# Altium project SmartGarden_A2.PrjPcb
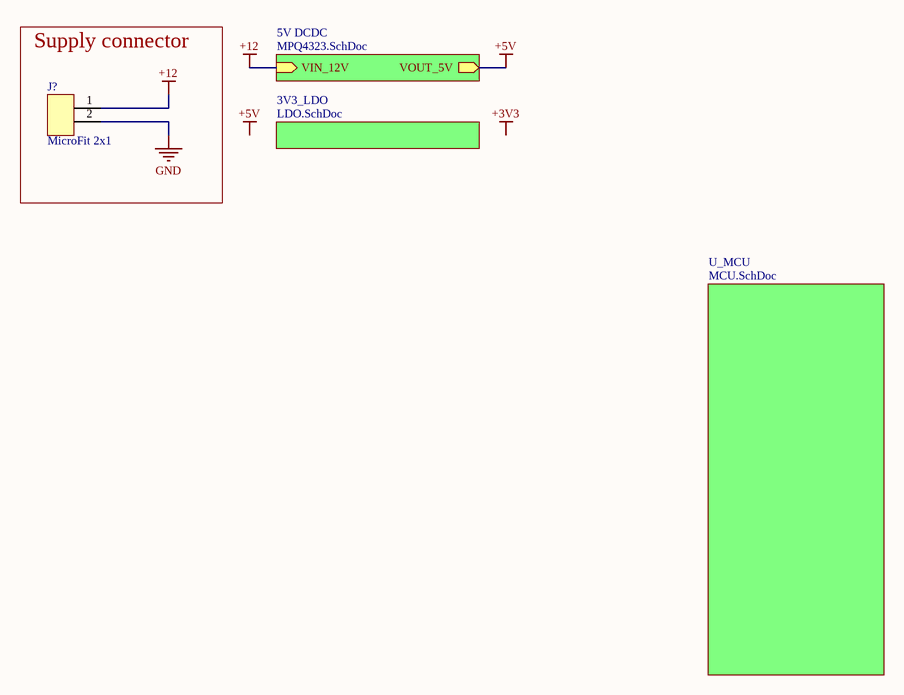
[diagram p0: SG_A2 Architecture.SchDoc]
3 sheets, 10 parts. Net scope: hierarchical (ports join the sheet entries above them; power ports are global).
Sheets:
  SG_A2 Architecture.SchDoc
    U_MCU = MCU.SchDoc
  Button.SchDoc

## Sheet SG_A2 Architecture.SchDoc
size A4; SheetNumber: 1; SheetTotal: 5

### Parts
J?  MicroFit 2x1  [MOLEX_43045-0200]

### Blocks framed on the sheet
Supply connector: J?

### Sub-sheets
3V3_LDO = LDO.SchDoc (file not in this document): no entries
5V DCDC = MPQ4323.SchDoc (file not in this document): VIN_12V (in), VOUT_5V (out)
U_MCU = MCU.SchDoc: no entries

### Nets
+5V: sheet 5V DCDC/VOUT_5V
+12: J?.1 ; sheet 5V DCDC/VIN_12V
GND: J?.2

### Notes on the sheet
- Labels drawn without touching a wire or pin: +3V3, +5V

## Sheet MCU.SchDoc
size A4; SheetNumber: 4; SheetTotal: 6
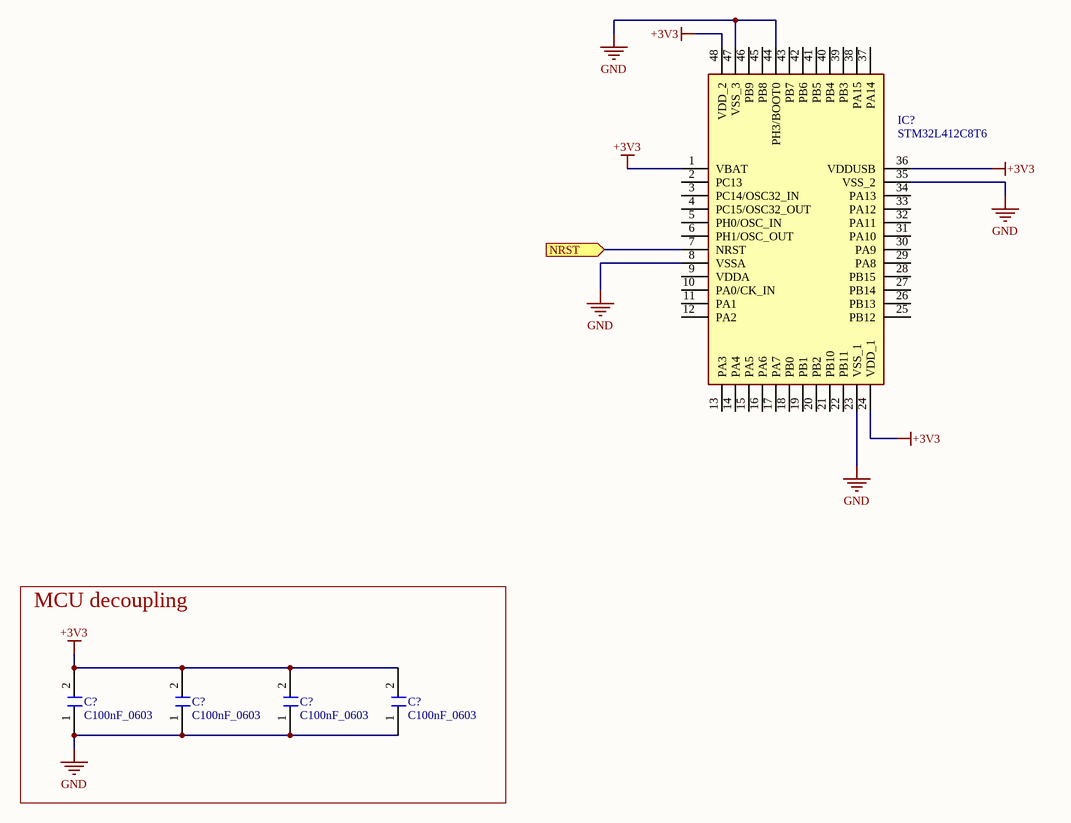
[diagram p1: MCU.SchDoc]

### Parts
(Parts that share a designator on the sheet are numbered #1, #2 ... from top to bottom, then left to right.)
C?#1  C100nF_0603  [Chip2PinSM127P600-8N]
C?#2  C100nF_0603  [Chip2PinSM127P600-8N]
C?#3  C100nF_0603  [Chip2PinSM127P600-8N]
C?#4  C100nF_0603  [Chip2PinSM127P600-8N]
IC?  STM32L412C8T6  [QFP50P900X900X160-48N]

### Blocks framed on the sheet
MCU decoupling: C?#1-C?#4

### Ports
NRST (in)

### Nets
+3V3: C?#1.2 C?#2.2 C?#3.2 C?#4.2 IC?.1(VBAT) IC?.24(VDD_1) IC?.36(VDDUSB) IC?.48(VDD_2)
GND: C?#1.1 C?#2.1 C?#3.1 C?#4.1 IC?.8(VSSA) IC?.23(VSS_1) IC?.35(VSS_2) IC?.44(PH3/BOOT0) IC?.47(VSS_3)
NetIC?_7: IC?.7(NRST) ; port NRST

Not connected (* = marked no-connect by the designer): IC? 2(PC13) 3(PC14/OSC32_IN) 4(PC15/OSC32_OUT) 5(PH0/OSC_IN) 6(PH1/OSC_OUT) 9(VDDA) 10(PA0/CK_IN) 11(PA1) 12(PA2) 13(PA3) 14(PA4) 15(PA5) 16(PA6) 17(PA7) 18(PB0) 19(PB1) 20(PB2) 21(PB10) 22(PB11) 25(PB12) 26(PB13) 27(PB14) 28(PB15) 29(PA8) 30(PA9) 31(PA10) 32(PA11) 33(PA12) 34(PA13) 37(PA14) 38(PA15) 39(PB3) 40(PB4) 41(PB5) 42(PB6) 43(PB7) 45(PB8) 46(PB9)

### Library data of the parts
IC? = STM32L412C8T6: STMICROELECTRONICS - STM32L412C8T6 - MCU, 32BIT, 80MHZ; Geometry.Height: 1.6mm; Mouser Part Number: 511-STM32L412C8T6; Mouser Price/Stock: https://www.mouser.co.uk/ProductDetail/STMicroelectronics/STM32L412C8T6?qs=l7cgNqFNU1hAS2azFRLB0A%3D%3D; Manufacturer_Name: STMicroelectronics; Manufacturer_Part_Number: STM32L412C8T6; Datasheet Link: https://www.st.com/resource/en/datasheet/stm32l412c8.pdf

## Sheet Button.SchDoc
size A4; SheetNumber: 5; SheetTotal: 5
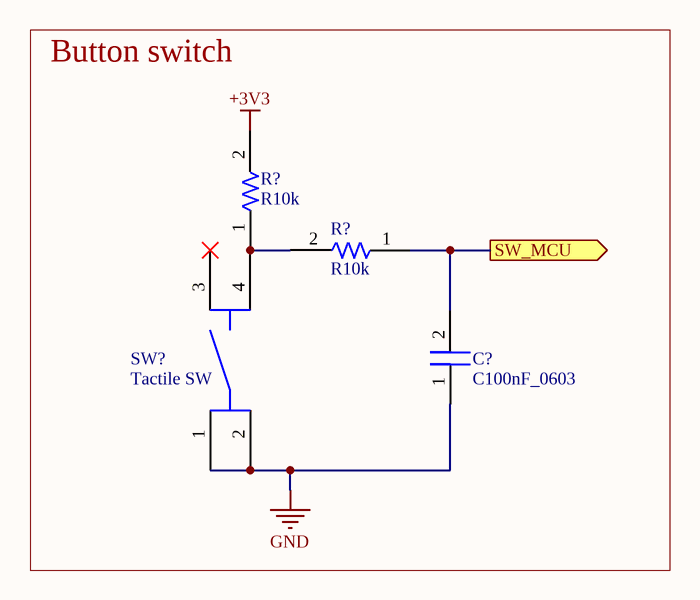
[diagram p2: Button.SchDoc]

### Parts
(Parts that share a designator on the sheet are numbered #1, #2 ... from top to bottom, then left to right.)
C?#5  C100nF_0603  [Chip2PinSM127P600-8N]
R?#1  R10k  [R0603]
R?#2  R10k  [R0603]
SW?  Tactile SW  [SW_2-1437565-7]

### Blocks framed on the sheet
Button switch: C?#5 R?#1 R?#2 SW?

### Ports
SW_MCU (out)

### Nets
+3V3: R?#1.2
GND: C?#5.1 SW?.1 SW?.2
NetC?#5_2: C?#5.2 R?#2.1 ; port SW_MCU
NetR?#1_1: R?#1.1 R?#2.2 SW?.4

Not connected (* = marked no-connect by the designer): SW? 3*

### Library data of the parts
R?#1 R?#2 = R10k_0603
SW? = SW_6x6

## Nets that join several sheets
+3V3: MCU (8 pins), Button (R?#1.2)
GND: SG_A2 Architecture (J?.2), MCU (9 pins), Button (C?#5.1 SW?.1 SW?.2)